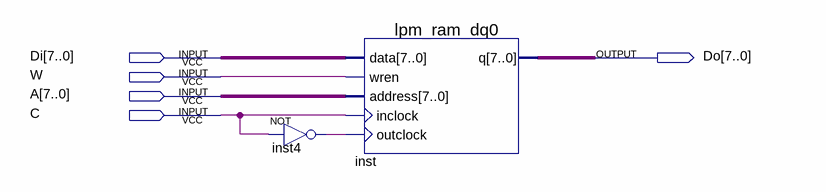
[diagram p0: schematic sheet]
// Quartus schematic RAM.bdf as structural Verilog: 2 symbols, 5 pins
module RAM (
  input  [7:0] Di,
  input  W,
  input  [7:0] A,
  input  C,
  output [7:0] Do
);

  wire inst4_out;

  not inst4 (inst4_out, C);
  lpm_ram_dq0 inst (.data(Di), .wren(W), .address(A), .inclock(C), .outclock(inst4_out), .q(Do));
endmodule
